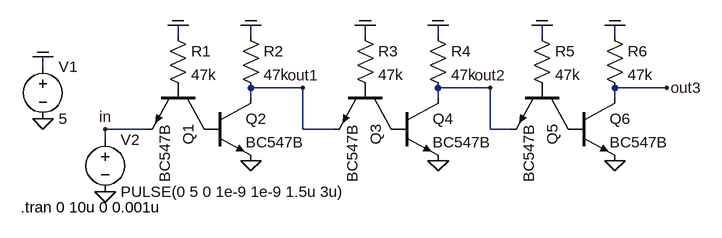
[diagram p0: schematic ttl2.asc]
ttl2.asc, the LTspice schematic file:
Version 4
SHEET 1 1012 680
WIRE 192 32 192 16
WIRE 304 32 304 16
WIRE 480 32 480 16
WIRE 592 32 592 16
WIRE 752 32 752 16
WIRE 864 32 864 16
WIRE -16 80 -16 64
WIRE 384 112 304 112
WIRE 672 112 592 112
WIRE 944 112 864 112
WIRE 304 128 304 112
WIRE 592 128 592 112
WIRE 864 128 864 112
WIRE 144 176 80 176
WIRE 384 176 384 112
WIRE 432 176 384 176
WIRE 672 176 672 112
WIRE 704 176 672 176
WIRE 80 192 80 176
FLAG -16 160 0
FLAG -16 64 COM
FLAG 304 224 0
FLAG 80 272 0
FLAG 192 16 COM
FLAG 304 16 COM
FLAG 80 176 in
FLAG 592 224 0
FLAG 480 16 COM
FLAG 592 16 COM
FLAG 864 224 0
FLAG 752 16 COM
FLAG 864 16 COM
FLAG 384 112 out1
FLAG 672 112 out2
FLAG 944 112 out3
SYMBOL voltage -16 64 R0
WINDOW 123 0 0 Left 2
WINDOW 39 0 0 Left 2
SYMATTR InstName V1
SYMATTR Value 5
SYMBOL res 176 16 R0
SYMATTR InstName R1
SYMATTR Value 47k
SYMBOL npn 240 112 R90
SYMATTR InstName Q1
SYMATTR Value BC547B
SYMBOL npn 240 128 R0
SYMATTR InstName Q2
SYMATTR Value BC547B
SYMBOL res 288 16 R0
SYMATTR InstName R2
SYMATTR Value 47k
SYMBOL voltage 80 176 R0
WINDOW 123 0 0 Left 2
WINDOW 39 0 0 Left 2
SYMATTR InstName V2
SYMATTR Value PULSE(0 5 0 1e-9 1e-9 1.5u 3u)
SYMBOL res 464 16 R0
SYMATTR InstName R3
SYMATTR Value 47k
SYMBOL npn 528 112 R90
SYMATTR InstName Q3
SYMATTR Value BC547B
SYMBOL npn 528 128 R0
SYMATTR InstName Q4
SYMATTR Value BC547B
SYMBOL res 576 16 R0
SYMATTR InstName R4
SYMATTR Value 47k
SYMBOL res 736 16 R0
SYMATTR InstName R5
SYMATTR Value 47k
SYMBOL npn 800 112 R90
SYMATTR InstName Q5
SYMATTR Value BC547B
SYMBOL npn 800 128 R0
SYMATTR InstName Q6
SYMATTR Value BC547B
SYMBOL res 848 16 R0
SYMATTR InstName R6
SYMATTR Value 47k
TEXT -50 296 Left 2 !.tran 0 10u 0 0.001u

The netlist it stands for:
* ttl2.asc
V1 COM 0 5
R1 COM P001 47k
Q1 P002 P001 in 0 BC547B
Q2 out1 P002 0 0 BC547B
R2 COM out1 47k
V2 in 0 PULSE(0 5 0 1e-9 1e-9 1.5u 3u)
R3 COM P003 47k
Q3 P004 P003 out1 0 BC547B
Q4 out2 P004 0 0 BC547B
R4 COM out2 47k
R5 COM P005 47k
Q5 P006 P005 out2 0 BC547B
Q6 out3 P006 0 0 BC547B
R6 COM out3 47k
.model NPN NPN
.model PNP PNP
.lib standard.bjt
.tran 0 10u 0 0.001u
.backanno
.end